# EAGLE design Standalone Kaleidoscope 8085 MPU BOARD V2 (EAGLE 8.7.0)
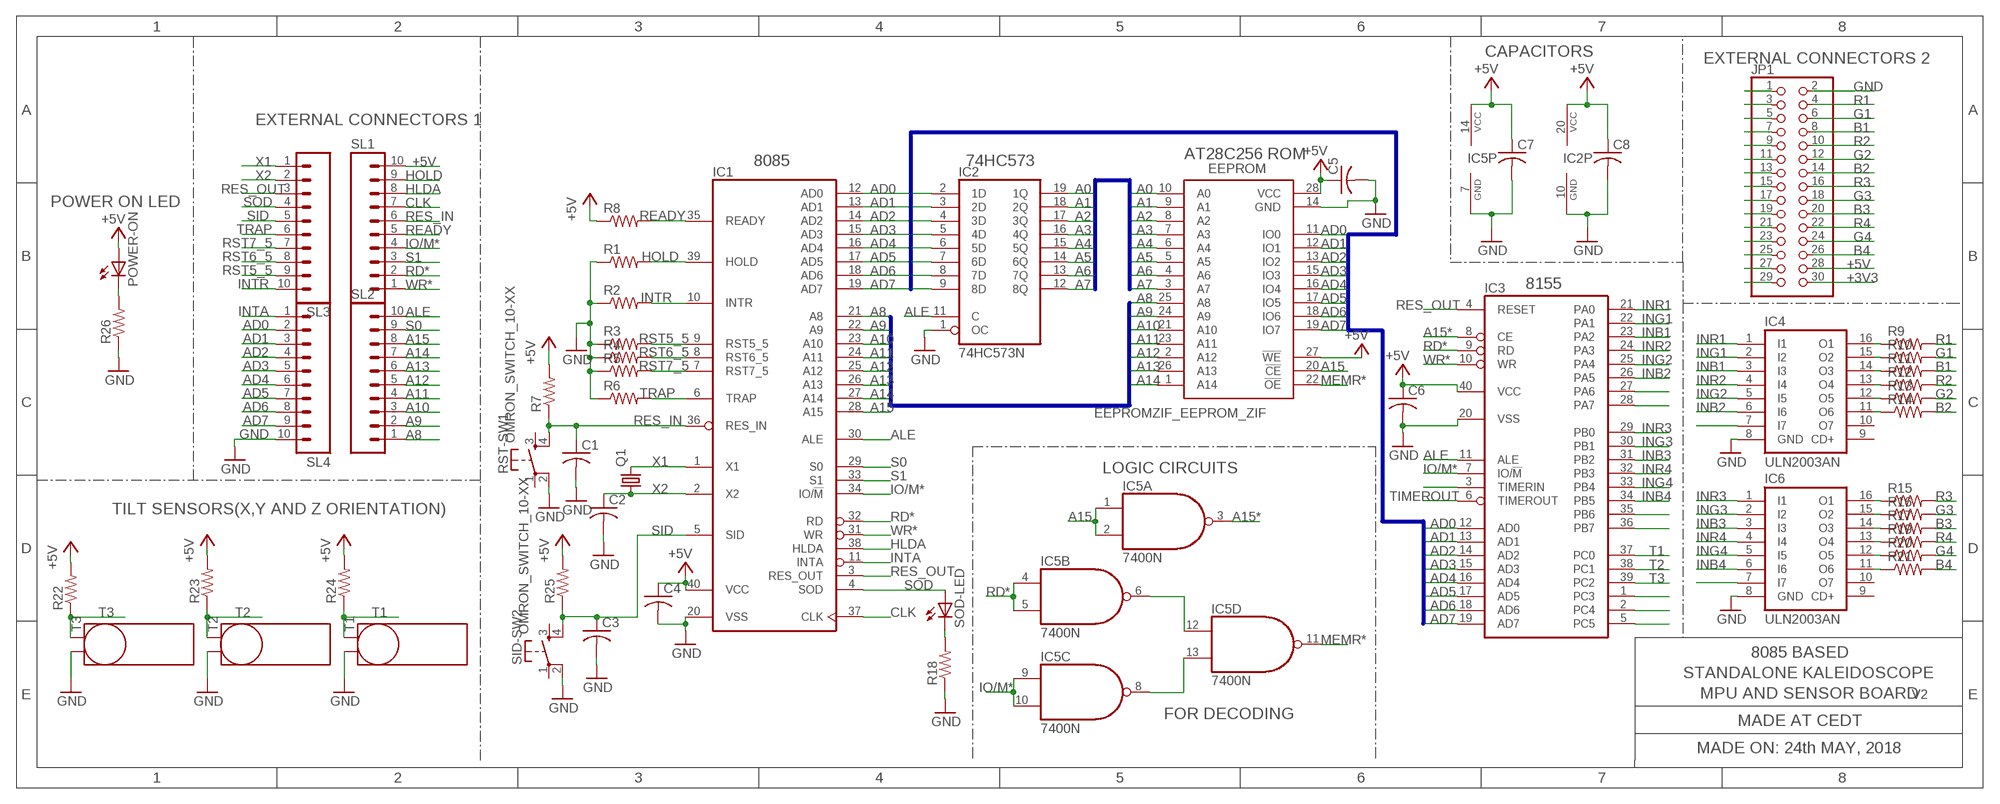
[diagram p0: schematic, sheet 1]

## Parts
C1  C-USC0805K  [C0805K]
C2  C-USC0805K  [C0805K]
C3  C-USC0805K  [C0805K]
C4  C-USC0805K  [C0805K]
C5  C-USC0805K  [C0805K]
C6  C-USC0805K  [C0805K]
C7  C-USC0805  [C0805]
C8  C-USC0805  [C0805]
EEPROM  EEPROMZIF_EEPROM_ZIF  [EEPROMZIF_DIL28-6-ZIF_SOCKET]
IC1  8085  [DIL40]
IC2  74HC573N  [DIL20]
IC3  8155  [DIL40]
IC4  ULN2003AN  [DIL16]
IC5  7400N  [DIL14]
IC6  ULN2003AN  [DIL16]
JP1  PINHD-2X15  [2X15]
POWER-ON  LEDCHIP-LED0805  [CHIP-LED0805]
Q1  CEDT_JANUARY_2015_V5_A_CRYSTALHC49US  [CEDT_JANUARY_2015_V5_A_HC49US]
R1  R-US_R0805  [R0805]
R2  R-US_R0805  [R0805]
R3  R-US_R0805  [R0805]
R4  R-US_R0805  [R0805]
R5  R-US_R0805  [R0805]
R6  R-US_R0805  [R0805]
R7  R-US_R0805  [R0805]
R8  R-US_R0805  [R0805]
R9  R-US_R0805  [R0805]
R10  R-US_R0805  [R0805]
R11  R-US_R0805  [R0805]
R12  R-US_R0805  [R0805]
R13  R-US_R0805  [R0805]
R14  R-US_R0805  [R0805]
R15  R-US_R0805  [R0805]
R16  R-US_R0805  [R0805]
R17  R-US_R0805  [R0805]
R18  R-US_R0805  [R0805]
R19  R-US_R0805  [R0805]
R20  R-US_R0805  [R0805]
R21  R-US_R0805  [R0805]
R22  R-US_R0805  [R0805]
R23  R-US_R0805  [R0805]
R24  R-US_R0805  [R0805]
R25  R-US_R0805  [R0805]
R26  R-US_R0805  [R0805]
RST-SW1  OMRON_SWITCH_10-XX  [B3F-10XX]
SID-SW2  OMRON_SWITCH_10-XX  [B3F-10XX]
SL1  CON-AMP-QUICK_M10  [CON-AMP-QUICK_10P]
SL2  CON-AMP-QUICK_M10  [CON-AMP-QUICK_10P]
SL3  CON-AMP-QUICK_M10  [CON-AMP-QUICK_10P]
SL4  CON-AMP-QUICK_M10  [CON-AMP-QUICK_10P]
SOD-LED  LEDCHIP-LED0805  [CHIP-LED0805]
T1  TILTSENSORE2.5-7  [TILTSENSOR]
T2  TILTSENSORE2.5-7  [TILTSENSOR]
T3  TILTSENSORE2.5-7  [TILTSENSOR]

## Nets
+3V3 [POWER]: JP1.29 JP1.30
+5V [POWER]: C4.1 C5.1 C6.1 C7.1 C8.1 EEPROM.27(!WE) EEPROM.28(VCC) IC1.40(VCC) IC2.20(VCC) IC3.40(VCC) IC5.14(P:VCC) JP1.27 JP1.28 POWER-ON.A R7.2 R8.1 R22.2 R23.2 R24.2 R25.2 SL1.10
A0: EEPROM.10(A0) IC2.19(1Q)
A1: EEPROM.9(A1) IC2.18(2Q)
A2: EEPROM.8(A2) IC2.17(3Q)
A3: EEPROM.7(A3) IC2.16(4Q)
A4: EEPROM.6(A4) IC2.15(5Q)
A5: EEPROM.5(A5) IC2.14(6Q)
A6: EEPROM.4(A6) IC2.13(7Q)
A7: EEPROM.3(A7) IC2.12(8Q)
A8: EEPROM.25(A8) IC1.21(A8) SL2.1
A9: EEPROM.24(A9) IC1.22(A9) SL2.2
A10: EEPROM.21(A10) IC1.23(A10) SL2.3
A11: EEPROM.23(A11) IC1.24(A11) SL2.4
A12: EEPROM.2(A12) IC1.25(A12) SL2.5
A13: EEPROM.26(A13) IC1.26(A13) SL2.6
A14: EEPROM.1(A14) IC1.27(A14) SL2.7
A15: EEPROM.20(!CE) IC1.28(A15) IC5.1(A:I0) IC5.2(A:I1) SL2.8
A15*: IC3.8(CE) IC5.3(A:O)
AD0: EEPROM.11(IO0) IC1.12(AD0) IC2.2(1D) IC3.12(AD0) SL4.2
AD1: EEPROM.12(IO1) IC1.13(AD1) IC2.3(2D) IC3.13(AD1) SL4.3
AD2: EEPROM.13(IO2) IC1.14(AD2) IC2.4(3D) IC3.14(AD2) SL4.4
AD3: EEPROM.15(IO3) IC1.15(AD3) IC2.5(4D) IC3.15(AD3) SL4.5
AD4: EEPROM.16(IO4) IC1.16(AD4) IC2.6(5D) IC3.16(AD4) SL4.6
AD5: EEPROM.17(IO5) IC1.17(AD5) IC2.7(6D) IC3.17(AD5) SL4.7
AD6: EEPROM.18(IO6) IC1.18(AD6) IC2.8(7D) IC3.18(AD6) SL4.8
AD7: EEPROM.19(IO7) IC1.19(AD7) IC2.9(8D) IC3.19(AD7) SL4.9
ALE: IC1.30(ALE) IC2.11(C) IC3.11(ALE) SL2.10
B1: JP1.7 JP1.8 R11.2
B2: JP1.13 JP1.14 R14.2
B3: JP1.19 JP1.20 R17.2
B4: JP1.25 JP1.26 R21.2
CLK: IC1.37(CLK) SL1.7
G1: JP1.5 JP1.6 R10.2
G2: JP1.11 JP1.12 R13.2
G3: JP1.17 JP1.18 R16.2
G4: JP1.23 JP1.24 R20.2
GND [POWER]: C1.2 C2.2 C3.2 C4.2 C5.2 C6.2 C7.2 C8.2 EEPROM.14(GND) IC1.20(VSS) IC2.1(OC) IC2.10(GND) IC3.20(VSS) IC4.8(GND) IC5.7(P:GND) IC6.8(GND) JP1.1 JP1.2 R1.1 R2.1 R3.1 R4.1 R5.1 R6.1 R18.1 R26.1 RST-SW1.2(P1) SID-SW2.2(P1) SL4.10 T1.- T2.- T3.-
HLDA: IC1.38(HLDA) SL1.8
HOLD: IC1.39(HOLD) R1.2 SL1.9
INB1: IC3.23(PA2) IC4.3(I3)
INB2: IC3.26(PA5) IC4.6(I6)
INB3: IC3.31(PB2) IC6.3(I3)
INB4: IC3.34(PB5) IC6.6(I6)
ING1: IC3.22(PA1) IC4.2(I2)
ING2: IC3.25(PA4) IC4.5(I5)
ING3: IC3.30(PB1) IC6.2(I2)
ING4: IC3.33(PB4) IC6.5(I5)
INR1: IC3.21(PA0) IC4.1(I1)
INR2: IC3.24(PA3) IC4.4(I4)
INR3: IC3.29(PB0) IC6.1(I1)
INR4: IC3.32(PB3) IC6.4(I4)
INTA: IC1.11(INTA) SL4.1
INTR: IC1.10(INTR) R2.2 SL3.10
IO/M*: IC1.34(IO/!M) IC3.7(IO/!M) IC5.9(C:I0) IC5.10(C:I1) SL1.4
MEMR*: EEPROM.22(!OE) IC5.11(D:O)
N$1: POWER-ON.C R26.2
N$2: IC4.16(O1) R9.1
N$3: IC4.15(O2) R10.1
N$4: IC4.14(O3) R11.1
N$5: IC5.6(B:O) IC5.12(D:I0)
N$6: IC5.8(C:O) IC5.13(D:I1)
N$7: IC4.13(O4) R12.1
N$8: IC4.12(O5) R13.1
N$9: IC4.11(O6) R14.1
N$10: IC6.11(O6) R21.1
N$11: IC6.12(O5) R20.1
N$12: IC6.13(O4) R19.1
N$13: IC3.3(TIMERIN)
N$14: IC6.14(O3) R17.1
N$15: IC6.15(O2) R16.1
N$16: R18.2 SOD-LED.C
N$17: IC6.16(O1) R15.1
N$24: IC3.27(PA6)
N$25: IC3.28(PA7)
N$26: IC3.35(PB6)
N$27: IC4.7(I7)
N$28: IC3.36(PB7)
N$32: IC3.1(PC3)
N$33: IC3.2(PC4)
N$34: IC3.5(PC5)
N$38: IC6.7(I7)
R1: JP1.3 JP1.4 R9.2
R2: JP1.9 JP1.10 R12.2
R3: JP1.15 JP1.16 R15.2
R4: JP1.21 JP1.22 R19.2
RD*: IC1.32(RD) IC3.9(RD) IC5.4(B:I0) IC5.5(B:I1) SL1.2
READY: IC1.35(READY) R8.2 SL1.5
RES_IN: C1.1 IC1.36(RES_IN) R7.1 RST-SW1.4(S1) SL1.6
RES_OUT: IC1.3(RES_OUT) IC3.4(RESET) SL3.3
RST5_5: IC1.9(RST5_5) R3.2 SL3.9
RST6_5: IC1.8(RST6_5) R4.2 SL3.8
RST7_5: IC1.7(RST7_5) R5.2 SL3.7
S0: IC1.29(S0) SL2.9
S1: IC1.33(S1) SL1.3
SID: C3.1 IC1.5(SID) R25.1 SID-SW2.4(S1) SL3.5
SOD: IC1.4(SOD) SL3.4 SOD-LED.A
T1: IC3.37(PC0) R24.1 T1.+
T2: IC3.38(PC1) R23.1 T2.+
T3: IC3.39(PC2) R22.1 T3.+
TIMEROUT: IC3.6(TIMEROUT)
TRAP: IC1.6(TRAP) R6.2 SL3.6
WR*: IC1.31(WR) IC3.10(WR) SL1.1
X1: IC1.1(X1) Q1.2 SL3.1
X2: C2.1 IC1.2(X2) Q1.1 SL3.2
Unconnected: IC4.9(CD+) IC4.10(O7) IC6.9(CD+) IC6.10(O7) RST-SW1.1(P) RST-SW1.3(S) SID-SW2.1(P) SID-SW2.3(S)

## Buses
A[0..7]
A[8..14]
AD[0..7]

## Notes on the sheet
- CAPACITORS
- EXTERNAL CONNECTORS 2
- EXTERNAL CONNECTORS 1
- AT28C256 ROM
- 8085 | 74HC573
- POWER ON LED
- 8155
- LOGIC CIRCUITS
- TILT SENSORS(X,Y AND Z ORIENTATION)
- 8085 BASED
- STANDALONE KALEIDOSCOPE
- MPU AND SENSOR BOARD | V2
- FOR DECODING
- MADE AT CEDT
- MADE ON: 24th MAY, 2018

## Library data of the parts
C1-C8 = rcl:C-US: CAPACITOR, American symbol; SPICEPREFIX: C
EEPROM = eeprom personal:EEPROMZIF_EEPROM_
IC1 = micro-intel:8085: MICROCOMPUTER/PERIPHERAL DEVICE; OC_FARNELL: unknown; OC_NEWARK: unknown
IC2 = 74xx-us:74*573: 8-bit D latch BUS DRIVER
IC3 = micro-intel:8155: MICROCOMPUTER/PERIPHERAL DEVICE; OC_FARNELL: unknown; OC_NEWARK: unknown
IC4 IC6 = uln-udn:ULN2003A: DRIVER ARRAY
IC5 = 74xx-us:74*00: Quad 2-input NAND gate
JP1 = pinhead:PINHD-2X15: PIN HEADER
POWER-ON SOD-LED = 01_adafruit:LED: LED OSRAM: - CHIPLED LG R971, LG N971, LY N971, LG Q971, LY Q971, LO R971, LY R971 LH N974, LH R974 LS Q976, LO Q976, LY Q976 LO Q996 - Hyper CHIPLED LW Q18S LB Q993, LB Q99A, LB R99A - SideLED LS A670, LO A670, LY A670, LG A670, LP A670 LB A673, LV A673, LT A673, LW A673 LH A674 LY A675 LS A676, LA A676, LO A676, LY A676, LW A676 LS A679, LY A679, LG A679 - Hyper Micro SIDELED® LS Y876, LA Y876, LO Y876, LY Y876 LT Y87S - SmartLED LW L88C, LW L88S LB L89C, LB L89S, LG L890 LS L89K, LO L89K, LY L89K LS L896, LA L896, LO L896, LY L896 - TOPLED LS T670, LO T670, LY T670, LG T670, LP T670 LSG T670, LSP T670, LSY T670, LOP T670, LYG T670 LG T671, LOG T671, LSG T671 LB T673, LV T673, LT T673, LW T673 LH T674 LS T676, LA T676, LO T676, LY T676, LB T676, LH T676, LSB T676, LW T676 LB T67C, LV T67C, LT T67C, LS T67K, LO T67K, LY T67K, LW E67C LS E67B, LA E67B, LO E67B, LY E67B, LB E67C, LV E67C, LT E67C LW T67C LS T679, LY T679, LG T679 LS T770, LO T770, LY T770, LG T770, LP T770 LB T773, LV T773, LT T773, LW T773 LH T774 LS E675, LA E675, LY E675, LS T675 LS T776, LA T776, LO T776, LY T776, LB T776 LHGB T686 LT T68C, LB T68C - Hyper Mini TOPLED® LB M676 - Mini TOPLED Santana® LG M470 LS M47K, LO M47K, LY M47K Source: http://www.osram.convergy.de/
Q1 = Board1-8085IRContolledMoodLamp:CEDT_JANUARY_2015_V5_A_CRYSTAL: Crystals Various standard crystals. Proven footprints. Spark Fun Electronics SKU : COM-00534
R1-R26 = rcl:R-US_: RESISTOR, American symbol; SPICEPREFIX: R
RST-SW1 SID-SW2 = CEDT_JANUARY_2015_v7:OMRON_SWITCH
SL1-SL4 = Board1-8085IRContolledMoodLamp:CON-AMP-QUICK_M10: AMP QUICK CONNECTOR; OC_FARNELL: unknown; OC_NEWARK: unknown
T1-T3 = tilt-sensor:TILTSENSOR: TILT SENSOR, American symbol

## Net classes
0 default: width 0.406 mm
1 POWER: width 0.61 mm

## Board
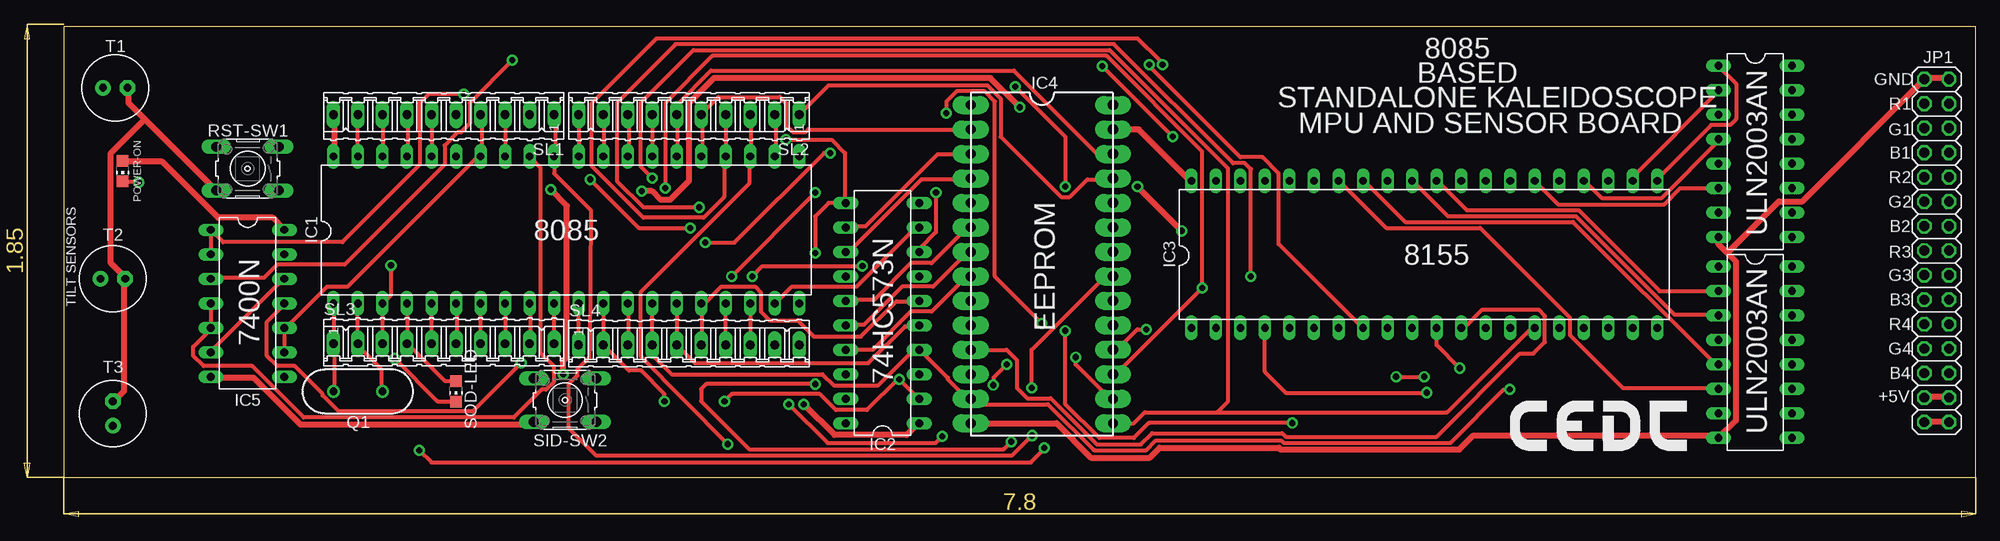
[diagram p1: board, top side]
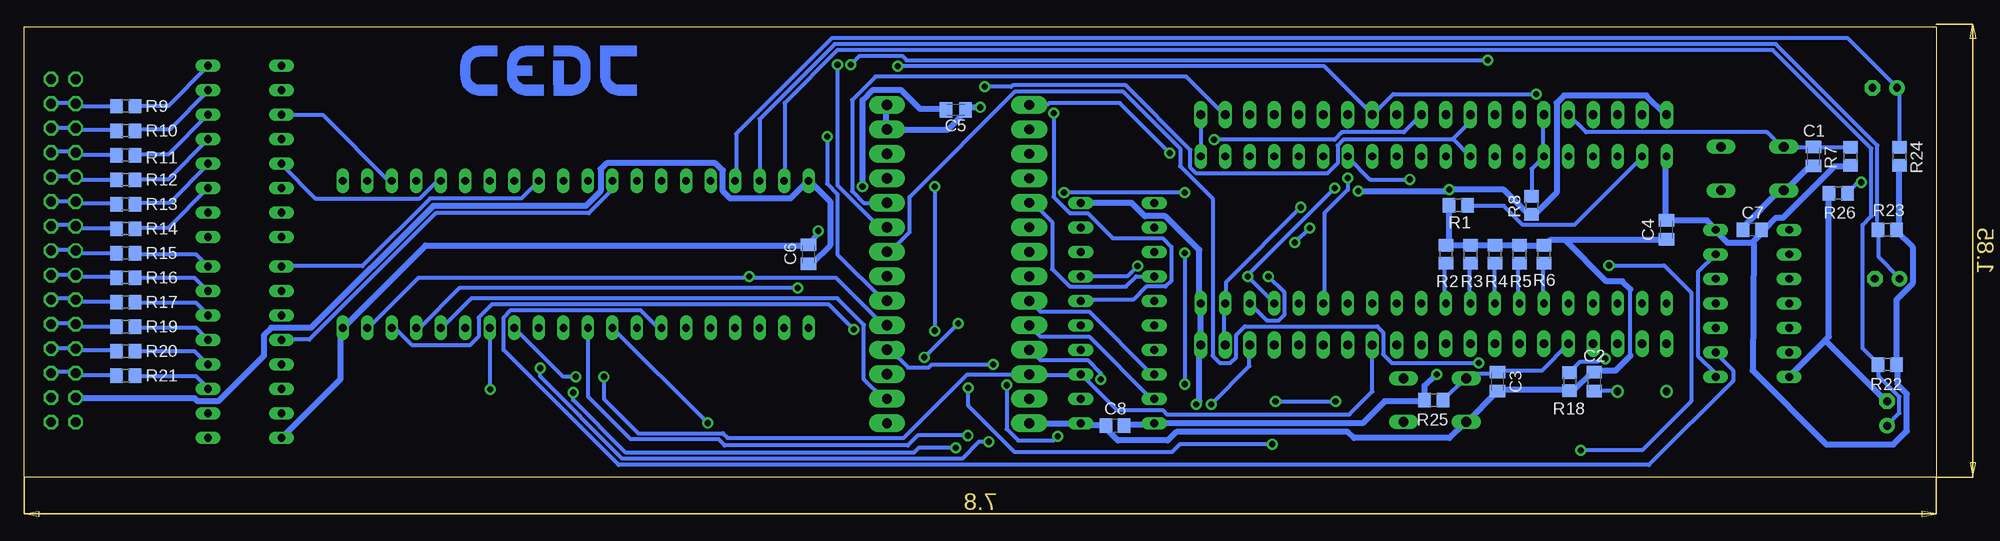
[diagram p2: board, bottom side, seen from below]

Size 198.12 x 46.74 mm. Coordinates in mm from the lower left corner, seen from the top.
Outline: 198.1,0 0,0 0,46.74 198.1,46.74
Outline: 198.12,0 198.12,46.74
Copper layers (1*16): Top 0.035mm / dielectric 1.5mm / Bottom 0.035mm
Design rules "drcsetting": minimum track width 12mil, minimum drill 25mil, track to track 8mil, track to pad 8mil, pad to pad 8mil, via to via 8mil, smd to smd 8mil, copper to edge 40mil, drill to drill 12mil, minimum pad ring 10mil, minimum via ring 10mil, stop-mask expansion 4mil, vias tented up to drill 0mil, thermal gap 10mil

### Footprints (pad centres in the part's own frame; a part is rotated, then mirrored left to right if it is on the bottom)
C0805K = smd 1.3 x 1.6: 1 -1,0; 2 1,0
C0805 = smd 1.3 x 1.5: 1 -0.95,0; 2 0.95,0
EEPROMZIF_DIL28-6-ZIF_SOCKET = drill 1.016 pad 1.88 long: 1 -24.13,-7.366; 2 -21.59,-7.366; 3 -19.05,-7.366; 4 -16.51,-7.366; 5 -13.97,-7.366; 6 -11.43,-7.366; 7 -8.89,-7.366; 8 -6.35,-7.366; 9 -3.81,-7.366; 10 -1.27,-7.366; 11 1.27,-7.366; 12 3.81,-7.366; 13 6.35,-7.366; 14 8.89,-7.366; 15 8.89,7.366; 16 6.35,7.366 | drill 1.1 pad 1.88 long: 17 3.81,7.366; 18 1.27,7.366; 19 -1.27,7.366; 20 -3.81,7.366; 21 -6.35,7.366; 22 -8.89,7.366; 23 -11.43,7.366; 24 -13.97,7.366; 25 -16.51,7.366; 26 -19.05,7.366; 27 -21.59,7.366; 28 -24.13,7.366
DIL40 = drill 0.813 long: 1 -24.13,-7.62; 2 -21.59,-7.62; 3 -19.05,-7.62; 4 -16.51,-7.62; 5 -13.97,-7.62; 6 -11.43,-7.62; 7 -8.89,-7.62; 8 -6.35,-7.62; 9 -3.81,-7.62; 10 -1.27,-7.62; 11 1.27,-7.62; 12 3.81,-7.62; 13 6.35,-7.62; 14 8.89,-7.62; 15 11.43,-7.62; 16 13.97,-7.62; 17 16.51,-7.62; 18 19.05,-7.62; 19 21.59,-7.62; 20 24.13,-7.62; 21 24.13,7.62; 22 21.59,7.62; 23 19.05,7.62; 24 16.51,7.62; 25 13.97,7.62; 26 11.43,7.62; 27 8.89,7.62; 28 6.35,7.62; 29 3.81,7.62; 30 1.27,7.62; 31 -1.27,7.62; 32 -3.81,7.62; 33 -6.35,7.62; 34 -8.89,7.62; 35 -11.43,7.62; 36 -13.97,7.62; 37 -16.51,7.62; 38 -19.05,7.62; 39 -21.59,7.62; 40 -24.13,7.62
DIL20 = drill 0.813 long: 1 -11.43,-3.81; 2 -8.89,-3.81; 3 -6.35,-3.81; 4 -3.81,-3.81; 5 -1.27,-3.81; 6 1.27,-3.81; 7 3.81,-3.81; 8 6.35,-3.81; 9 8.89,-3.81; 10 11.43,-3.81; 11 11.43,3.81; 12 8.89,3.81; 13 6.35,3.81; 14 3.81,3.81; 15 1.27,3.81; 16 -1.27,3.81; 17 -3.81,3.81; 18 -6.35,3.81; 19 -8.89,3.81; 20 -11.43,3.81
DIL16 = drill 0.813 long: 1 -8.89,-3.81; 2 -6.35,-3.81; 3 -3.81,-3.81; 4 -1.27,-3.81; 5 1.27,-3.81; 6 3.81,-3.81; 7 6.35,-3.81; 8 8.89,-3.81; 9 8.89,3.81; 10 6.35,3.81; 11 3.81,3.81; 12 1.27,3.81; 13 -1.27,3.81; 14 -3.81,3.81; 15 -6.35,3.81; 16 -8.89,3.81
DIL14 = drill 0.813 long: 1 -7.62,-3.81; 2 -5.08,-3.81; 3 -2.54,-3.81; 4 0,-3.81; 5 2.54,-3.81; 6 5.08,-3.81; 7 7.62,-3.81; 8 7.62,3.81; 9 5.08,3.81; 10 2.54,3.81; 11 0,3.81; 12 -2.54,3.81; 13 -5.08,3.81; 14 -7.62,3.81
2X15 = drill 1.016 octagon: 1 -17.78,-1.27; 2 -17.78,1.27; 3 -15.24,-1.27; 4 -15.24,1.27; 5 -12.7,-1.27; 6 -12.7,1.27; 7 -10.16,-1.27; 8 -10.16,1.27; 9 -7.62,-1.27; 10 -7.62,1.27; 11 -5.08,-1.27; 12 -5.08,1.27; 13 -2.54,-1.27; 14 -2.54,1.27; 15 0,-1.27; 16 0,1.27; 17 2.54,-1.27; 18 2.54,1.27; 19 5.08,-1.27; 20 5.08,1.27; 21 7.62,-1.27; 22 7.62,1.27; 23 10.16,-1.27; 24 10.16,1.27; 25 12.7,-1.27; 26 12.7,1.27; 27 15.24,-1.27; 28 15.24,1.27; 29 17.78,-1.27; 30 17.78,1.27
CHIP-LED0805 = smd 1.2 x 1.2: A 0,-1.05; C 0,1.05
CEDT_JANUARY_2015_V5_A_HC49US = drill 0.813: 1 -2.54,0; 2 2.54,0
R0805 = smd 1.3 x 1.5: 1 -0.95,0; 2 0.95,0
B3F-10XX = drill 1.016 long: 1 -3.251,2.261; 2 3.251,2.261; 3 -3.251,-2.261; 4 3.251,-2.261
CON-AMP-QUICK_10P = drill 0.914 long: 1 -11.43,0; 2 -8.89,0; 3 -6.35,0; 4 -3.81,0; 5 -1.27,0; 6 1.27,0; 7 3.81,0; 8 6.35,0; 9 8.89,0; 10 11.43,0
TILTSENSOR = drill 0.813 pad 1.6: + -1.27,0 | drill 0.813 pad 1.6 octagon: - 1.27,0

### Placement (x,y rotation side)
C1  12.7,33.27 270 bottom
C2  35.43,9.91 90 bottom
C3  45.47,9.91 270 bottom
C4  27.94,25.65 270 bottom
C5  101.6,38.1 180 bottom
C6  116.84,23.11 90 bottom
C7  19.05,25.65 180 bottom
C8  85.09,5.33 180 bottom
EEPROM  101.35,14.48 270 top
IC1  52.07,25.65 0 top
IC2  84.84,17.02 90 top
IC3  140.97,23.11 0 top
IC4  175.26,33.78 270 top
IC5  19.05,18.03 270 top
IC6  175.26,12.95 270 top
JP1  194.06,23.5 270 top
POWER-ON  6.1,31.75 180 top
Q1  30.48,8.89 180 top
R1  49.53,28.19 0 bottom
R2  50.8,23.11 270 bottom
R3  48.26,23.11 270 bottom
R4  45.72,23.11 270 bottom
R5  43.18,23.11 270 bottom
R6  40.64,23.11 270 bottom
R7  8.89,33.27 270 bottom
R8  41.91,28.19 90 bottom
R9  187.58,38.48 180 bottom
R10  187.58,35.94 180 bottom
R11  187.58,33.4 180 bottom
R12  187.58,30.86 180 bottom
R13  187.58,28.32 180 bottom
R14  187.58,25.78 180 bottom
R15  187.58,23.24 180 bottom
R16  187.58,20.7 180 bottom
R17  187.58,18.16 180 bottom
R18  37.97,9.91 90 bottom
R19  187.58,15.62 180 bottom
R20  187.58,13.08 180 bottom
R21  187.58,10.54 180 bottom
R22  5.08,11.68 0 bottom
R23  5.08,25.65 0 bottom
R24  3.81,33.27 270 bottom
R25  52.07,8 180 bottom
R26  10.16,29.46 0 bottom
RST-SW1  19.05,32 180 top
SID-SW2  51.94,8 180 top
SL1  39.37,37.59 180 top
SL2  64.77,37.59 180 top
SL3  39.37,13.84 0 top
SL4  64.77,13.72 0 top
SOD-LED  40.64,8.89 180 top
T1  5.33,40.39 0 top
T2  5.08,20.57 0 top
T3  5.08,6.6 90 top
U$1  [LOGO-CEDT-BOT-18MM]  134.62,39.62 0 top
U$4  [LOGO-CEDT-SILK-18MM]  149.86,2.79 0 top

### Tracks (layer width: path | path; a pad name or v marks a point on that pad's centre or on a via)
+3V3
  Top 0.61: JP1.29 192.79,5.74 195.22,5.74 JP1.30
+5V  (via drill 0.64)
  Top 0.61: IC1.40 28.04,33.33 28.04,37.59 SL1.10 | POWER-ON.A 6.1,32.72 10.21,32.72 16,26.92 21.64,26.92 22.86,25.7 IC5.14 | v50.44,29.82 52.12,28.14 52.12,12.45 51.74,12.06 v51.74,10.64 | JP1.27 192.79,8.33 195.22,8.33 JP1.28 | EEPROM.27 111.4,36.07 116.74,30.73 IC3.40 | v59.89,29.67 60.96,29.67 61.87,28.75 62.79,28.75 64.77,30.73 64.77,38.81 67.36,41.4 96.01,41.4 v99.06,38.35
  Bottom 0.61: 53.03,7.87 R25.2 | C8.1 84.12,5.44 81.23,5.44 IC2.20 59.44,5.59 57.15,7.87 53.15,7.87 R25.2 | SL1.10 28.04,37.59 30.02,39.57 38.56,39.57 39.32,38.81 39.32,29.52 41.45,27.38 41.91,27.38 R8.1 42.06,27.53 42.52,27.53 44.81,29.82 v50.44,29.82 50.6,29.67 v59.89,29.67 | R24.2 3.81,26.01 3.96,25.86 R23.2 4.12,25.55 2.44,23.88 2.44,20.07 4.12,18.39 4.12,11.68 R22.2 3.96,11.53 3.96,9.55 3.05,8.64 3.05,4.8 4.45,3.4 11.38,3.4 19.02,11.05 18.9,24.18 19.05,24.33 | 19.05,24.33 18.14,25.25 18.14,25.55 C7.1 17.83,25.7 16.61,26.92 15.85,26.92 10.52,32.26 8.99,32.26 R7.2 | 19.05,24.33 21.64,24.33 22.86,25.55 IC5.14 23.01,25.86 23.77,26.62 27.89,26.62 C4.1 28.04,26.92 28.04,33.17 IC1.40 | 52.88,8.18 R25.2 | EEPROM.28 108.81,38.51 108.81,36.22 EEPROM.27 102.41,36.07 100.74,37.74 100.74,38.05 C5.1 100.43,38.35 v99.06,38.35 | C6.1 116.74,22.2 116.43,22.2 114.61,24.03 114.61,28.6 116.74,30.73 IC3.40 117.04,30.58 118.72,28.91 124.97,28.91 125.73,29.67 125.73,31.8 126.49,32.56 137.77,32.56 138.38,31.95 138.38,29.67 139.9,28.14 155.75,28.14 168.4,15.49 172.52,15.49 173.28,14.73 173.28,12.6 178,7.87 180.14,7.87 180.44,8.18 192.79,8.18 JP1.27 | R25.2 53.02,9.49 v51.74,10.64
A0
  Bottom 0.406: EEPROM.10 92.81,14.58 87.78,14.58 81.38,8.18 81.08,8.18 IC2.19
A1
  Bottom 0.406: IC2.18 81.08,10.77 81.38,10.77 87.78,17.17 92.81,17.17 93.88,18.24 EEPROM.9
A2
  Top 0.406: IC2.17 83.82,13.21 87.78,17.17 89.92,17.17 93.57,20.83 EEPROM.8
A3
  Top 0.406: IC2.16 81.08,15.8 82.91,15.8 86.87,19.76 90.07,19.76 93.57,23.27 93.88,23.27 EEPROM.7
A4
  Top 0.406: IC2.15 81.08,18.39 83.97,18.39 87.78,22.2 89.92,22.2 93.57,25.86 93.88,25.86 EEPROM.6
A5
  Bottom 0.406: IC2.14 82.91,20.83 83.97,19.76 89.76,19.76 91.59,21.59 91.59,26.47 93.57,28.45 EEPROM.5
A6
  Top 0.406: IC2.13 81.08,23.42 81.38,23.42 88.85,30.89 93.88,30.89 EEPROM.4
A7
  Top 0.406: IC2.12 81.08,26.01 83.06,26.01 90.53,33.48 93.88,33.48 EEPROM.3
A8
  Top 0.406: SL2.1 79.25,40.64 95.71,40.64 97.08,39.27 97.08,35.31 103.33,29.06 104.24,29.06 106.07,30.89 108.66,30.89 EEPROM.25
  Bottom 0.406: SL2.1 IC1.21
A9
  Top 0.406: IC1.22 73.76,33.33 73.76,37.59 SL2.2
  Bottom 0.406: EEPROM.24 111.1,28.45 112.32,29.67 112.32,39.12 109.88,41.55 77.72,41.55 73.76,37.59 SL2.2
A10  (via drill 0.64)
  Top 0.406: SL2.3 71.17,37.59 71.17,33.33 IC1.23 71.02,33.17 71.02,30.43 59.74,19.15 59.74,12.6 v68.78,3.43 | EEPROM.21 107.9,20.83 100.28,13.21 v100.28,9.25
  Bottom 0.406: v100.28,9.25 100.28,7.42 95.45,2.59 79.2,2.59 78.36,3.43 v68.78,3.43
A11  (via drill 0.64)
  Top 0.406: SL2.4 IC1.24 68.43,33.17 68.43,29.06 66.29,26.92 60.05,26.92 54.71,32.26 54.71,38.81 61.42,45.52 111.25,45.52 113.54,43.23 113.54,43.08 v113.84,42.77
  Bottom 0.406: v113.84,42.77 113.84,30.28 109.58,26.01 108.81,26.01 EEPROM.23
A12
  Top 0.406: IC1.25 66.14,33.33 66.14,37.59 SL2.5 66.14,37.74 67.82,39.42 74.22,39.42 74.83,38.81 74.83,36.52 75.59,35.76 76.81,35.76 77.11,36.07 EEPROM.2
A13
  Top 0.406: IC1.26 63.55,33.33 63.55,37.59 SL2.6 63.55,37.74 63.55,38.66 67.06,42.16 98.45,42.16 106.98,33.63 108.66,33.63 EEPROM.26
A14  (via drill 0.64)
  Top 0.406: SL2.7 IC1.27 | v79.4,33.63 78.79,33.63 69.49,24.33 v66.45,24.33 | v64.92,25.86 59.59,25.86 v54.56,30.89
  Bottom 0.406: v79.4,33.63 84.58,38.81 91.9,38.81 92.05,38.66 93.88,38.66 EEPROM.1 | v64.92,25.86 v66.45,24.33 | v54.56,30.89 58.67,30.89 60.96,33.17 IC1.27
A15  (via drill 0.64)
  Top 0.406: IC5.2 IC5.1 16.51,24.38 28.85,24.38 36.88,32.41 36.88,38.81 37.8,39.73 v41.45,39.73 | IC1.28 58.52,33.33 58.52,37.59 SL2.8 | v107.59,42.62 v114.91,35.31
  Bottom 0.406: v41.45,39.73 56.24,39.73 58.37,37.59 SL2.8 58.52,37.74 63.4,42.62 v107.59,42.62 | v114.91,35.31 114.91,30.43 113.84,29.36 113.84,23.11 109.12,18.39 108.81,18.39 EEPROM.20
A15*  (via drill 0.64)
  Top 0.406: v46.48,43.23 42.06,38.81 42.06,36.68 41.15,35.76 40.84,35.76 39.47,34.39 39.47,32.41 29.11,22.05 22.1,22.05 20.73,20.68 15.24,20.68 IC5.3 | v112.47,42.77 112.78,42.47 112.78,42.32 121.92,33.17 124.21,33.17 125.88,31.5 125.88,24.18 134.57,15.49 IC3.8
  Bottom 0.406: v46.48,43.23 106.68,43.23 107.14,43.69 111.56,43.69 v112.47,42.77
AD0  (via drill 0.64, 0.65)
  Top 0.406: IC1.12 55.93,17.93 55.93,13.82 SL4.2 58.55,11.05 59.82,11.05 62.23,8.64 v62.23,7.87 | IC2.2 88.54,8.18 v86.56,10.16 86.41,10.16 83.21,6.96 80.01,6.96 78.33,8.64 69.22,8.64 v68.45,7.87 | IC3.12 145.09,15.49 146.91,17.32 152.86,17.32 153.47,16.71 153.47,14.02 152.27,12.83 150.88,12.83 142.24,4.19 126.62,4.19 126.24,4.57 112.78,4.57 111.61,3.4 107.04,3.4 102.26,8.18 99.82,8.18 98.75,9.25 98.75,12.14 97.69,13.21 EEPROM.11
  Bottom 0.406: v86.56,10.16 86.56,10.77 87.94,12.14 92.81,12.14 93.88,13.21 EEPROM.11 | v68.45,7.87 v62.23,7.87
AD1  (via drill 0.65)
  Top 0.406: IC1.13 58.52,17.93 58.52,13.82 SL4.3 | v138.05,10.41 v140.97,10.41
  Bottom 0.406: 147.22,15.49 IC3.13 142.24,10.41 v140.97,10.41 | 58.52,13.66 SL4.3 58.42,8.89 60.81,6.5 79.7,6.5 80.16,6.96 84.89,6.96 88.54,10.62 IC2.3 88.7,10.62 93.88,10.62 EEPROM.12 94.03,10.62 100.43,10.62 106.98,4.06 125.22,4.06 125.73,4.57 134.49,4.57 138.05,8.13 v138.05,10.41 138.05,10.54
AD2  (via drill 0.64)
  Top 0.406: SL4.4 IC1.14 | v149.81,9.09 149.2,9.09 143.69,3.58 126.37,3.58 126.14,3.81 113.16,3.81 112.14,2.79 106.78,2.79 106.76,2.82 106.7,2.82 101.96,7.57 94.49,7.57 94.03,8.03 EEPROM.13 93.88,8.18 93.57,8.18 91.59,10.16 91.59,10.31 88.7,13.21 IC2.4 88.54,13.06 87.94,13.06 84.4,9.53 79.76,9.53 78.61,10.67 62.99,10.67 60.96,12.7 SL4.4 | 61.11,13.66 SL4.4
  Bottom 0.406: v149.81,9.09 149.81,15.49 IC3.14
AD3  (via drill 0.64)
  Top 0.406: IC1.15 63.55,17.93 63.55,13.82 SL4.5 65.38,11.84 83.36,11.84 87.17,15.65 88.54,15.65 IC2.5 | IC3.15 152.09,15.49 143.33,6.73 119.51,6.73 | v60.96,31.04 59.74,32.26 59.74,38.81 65.23,44.3 108.36,44.3 120.65,32 120.65,7.87 119.51,6.73 | EEPROM.15 110.87,5.59 112.01,6.73 119.51,6.73
  Bottom 0.406: v60.96,31.04 60.96,29.82 63.4,27.38 63.4,18.09 IC1.15
AD4  (via drill 0.64)
  Top 0.406: SL4.6 66.14,13.82 66.14,17.93 IC1.16 66.29,17.93 68.12,19.76 71.63,19.76 72.24,19.15 72.24,17.17 73.15,16.26 76.05,16.26 77.72,14.58 82.6,14.58 86.26,18.24 88.54,18.24 IC2.6 | v91.44,37.74 91.44,38.96 92.51,40.03 95.4,40.03 96.47,38.96 96.47,20.83 v101.35,15.95 | v104.85,12.45 104.85,11.68 108.36,8.18 108.66,8.18 EEPROM.16
  Bottom 0.406: IC3.16 154.84,15.49 151.79,18.54 113.84,18.54 111.1,15.8 111.1,10.16 109.12,8.18 108.81,8.18 EEPROM.16 | v91.44,37.74 91.44,29.06 89.76,27.38 87.94,27.38 85.34,24.79 80.16,24.79 79.25,23.88 79.25,20.37 79.86,19.76 81.84,19.76 83.21,18.39 88.54,18.39 IC2.6 | v104.85,12.45 v101.35,15.95
AD5  (via drill 0.64)
  Top 0.406: SL4.7 IC1.17 | v82.75,21.89 72.39,21.89 v71.32,20.83 | EEPROM.17 108.81,10.77 109.12,10.77 v117.96,19.61 117.96,33.78 108.05,43.69 67.21,43.69 62.33,38.81 v62.33,29.97
  Bottom 0.406: IC2.7 83.82,20.83 v82.75,21.89 | IC1.17 68.58,18.09 v71.32,20.83 71.32,20.98 v62.33,29.97 | IC3.17 157.12,15.49 153.01,19.61 v117.96,19.61
AD6  (via drill 0.64)
  Top 0.406: IC1.18 71.17,17.93 71.17,13.82 SL4.8 | v90.37,29.52 90.37,25.4 88.7,23.72 88.7,23.42 IC2.8 | v69.19,20.83 v77.88,29.52 | v112.17,15.34 111.25,15.34 109.12,13.21 EEPROM.18 | v75.13,7.57 79.15,3.56 90.32,3.56 v91.01,4.24 | v96.32,9.55 96.32,10.31 v97.69,11.68
  Bottom 0.406: v77.88,29.52 v90.37,29.52 | v69.19,20.83 67.51,19.15 67.51,16.87 68.12,16.26 69.34,16.26 IC1.18 | IC3.18 159.72,15.49 157.89,13.66 151.94,13.66 151.03,14.58 151.03,16.56 149.66,17.93 114.76,17.93 v112.17,15.34 | v75.13,7.57 71.17,11.53 71.17,13.66 SL4.8 | v96.32,9.55 96.32,5 | 96.32,5 96.32,4.98 | v97.69,11.68 104.09,11.68 104.39,11.38 106.53,11.38 108.36,13.21 EEPROM.18 | v91.01,4.24 91.44,3.81 95.12,3.81 96.32,5
AD7  (via drill 0.64)
  Top 0.406: IC2.9 88.54,25.86 88.24,25.86 82.14,19.76 75.44,19.76 73.76,18.09 IC1.19 | v65.84,27.99 60.05,27.99 57.3,30.73 57.3,38.81 63.4,44.91 108.81,44.91 121.16,32.56 122.38,32.56 122.99,31.95 v122.99,20.83
  Bottom 0.406: SL4.9 73.76,13.82 73.76,17.93 IC1.19 73.61,18.09 73.61,20.22 v65.84,27.99 | 122.99,20.68 114,20.68 109.12,15.8 108.81,15.8 EEPROM.19 | 122.99,20.68 157.28,20.68 162.46,15.49 IC3.19 | v122.99,20.83 122.99,20.68
ALE  (via drill 0.64, 0.65)
  Top 0.406: SL2.10 IC1.30 | v74.83,35 79.55,35 80.92,33.63 80.92,28.45 IC2.11 79.25,28.45 77.85,27.05 v77.85,23.24 | v77.85,9.65 66.55,9.65 66.04,9.14 66.04,7.87 71.02,2.9 97.38,2.9 v98.17,3.68 | v144.65,11.3 142.24,13.72 IC3.11
  Bottom 0.406: v74.83,35 62.33,35 61.57,35.76 55.17,35.76 SL2.10 | v77.85,23.24 v77.85,9.65 | v98.17,3.68 99.19,3.68 100.94,1.93 136.13,1.93 144.65,10.45 v144.65,11.3
B1
  Bottom 0.406: R11.2 188.67,33.48 192.63,33.48 192.79,33.63 JP1.7 192.94,33.78 195.22,33.78 JP1.8
B2
  Bottom 0.406: R14.2 188.67,25.86 192.63,25.86 192.79,26.01 JP1.13 192.94,26.16 195.22,26.16 JP1.14
B3
  Bottom 0.406: R17.2 188.67,18.24 192.63,18.24 192.79,18.39 JP1.19 192.94,18.54 195.22,18.54 JP1.20
B4
  Bottom 0.406: R21.2 188.67,10.62 192.63,10.62 192.79,10.77 JP1.25 192.94,10.92 195.22,10.92 JP1.26
CLK
  Top 0.406: IC1.37 35.66,33.33 35.66,37.59 SL1.7
G1
  Bottom 0.406: R10.2 188.67,36.07 192.79,36.07 JP1.5 192.94,36.22 195.22,36.22 JP1.6
G2
  Bottom 0.406: R13.2 188.67,28.45 192.79,28.45 JP1.11 192.94,28.6 195.22,28.6 JP1.12
G3
  Bottom 0.406: R16.2 188.67,20.83 192.79,20.83 JP1.17 192.94,20.98 195.22,20.98 JP1.18
G4
  Bottom 0.406: R20.2 188.67,13.21 192.79,13.21 JP1.23 192.94,13.36 195.22,13.36 JP1.24
GND  (via drill 0.64)
  Top 0.61: 8.38,37.13 15.7,29.82 RST-SW1.2 | 8.38,37.13 6.71,38.81 6.71,40.34 T1.- | T3.- 5.18,7.87 6.25,8.94 6.25,20.52 T2.- 6.25,20.83 4.88,22.2 4.88,33.63 8.38,37.13 | v76.66,7.57 79.86,4.37 87.33,4.37 88.54,5.59 IC2.1 | IC5.7 15.24,10.31 19.66,10.31 24.54,5.44 48.31,5.44 48.62,5.74 SID-SW2.2 | JP1.2 195.22,41.4 192.79,41.4 JP1.1 192.63,41.1 180.14,28.6 177.7,28.6 172.36,23.27 | v115.82,25.55 v111.25,30.12 | IC4.8 171.45,24.18 172.36,23.27 | 172.36,23.27 173.28,22.35 173.28,5.89 IC6.8 171.2,4.32 146.05,4.32 144.6,2.87 126.07,2.87 125.89,3.05 113.54,3.05 112.52,2.03 106.43,2.03 102.87,5.59 EEPROM.14
  Bottom 0.406: 31.7,12.6 31.7,19.51
  Bottom 0.61: C7.2 19.96,25.7 19.96,26.01 16.31,29.67 15.85,29.67 RST-SW1.2 15.54,29.82 13.11,32.26 12.8,32.26 C1.2 | 11.51,14.2 15.24,10.46 IC5.7 | 11.51,14.2 11.12,14.58 11.12,29.36 R26.1 | 11.51,14.2 5.18,7.87 T3.- | IC2.10 83.36,28.45 81.99,27.08 79.86,27.08 76.35,23.57 76.35,18.24 IC1.20 SL4.10 76.35,13.51 76.35,7.87 v76.66,7.57 | R1.1 50.44,28.14 50.44,24.18 R2.1 50.75,24.03 48.46,24.03 R3.1 48.16,24.03 45.87,24.03 R4.1 45.72,24.03 43.43,24.03 R5.1 43.13,24.03 40.69,24.03 R6.1 40.39,24.18 39.93,24.64 38.48,24.64 | 38.48,24.64 28.04,24.64 C4.2 | EEPROM.14 IC2.1 88.54,5.59 88.39,5.44 86.11,5.44 C8.2 85.8,5.13 85.8,4.83 84.78,3.81 79.63,3.81 78.74,4.7 60.96,4.7 60.33,4.06 50.44,4.06 48.92,5.59 SID-SW2.2 48.62,5.74 45.57,8.79 C3.2 45.26,9.09 38.25,9.09 R18.1 37.95,9.09 37.49,9.09 35.81,10.77 35.51,10.77 C2.2 35.2,11.07 33.22,11.07 31.7,12.6 | v111.25,30.12 111.25,39.12 110.19,40.18 107.29,40.18 105.31,38.2 102.72,38.2 C5.2 | v115.82,25.55 115.82,25.25 116.74,24.33 C6.2 116.89,24.03 156.51,24.03 165.05,15.49 IC3.20 165.35,15.34 165.35,10.16 IC6.8 | 31.7,19.51 32.51,20.32 34.16,20.32 38.48,24.64
HLDA
  Top 0.406: IC1.38 33.07,33.33 33.07,37.59 SL1.8
HOLD
  Top 0.406: IC1.39 SL1.9
  Bottom 0.406: R1.2 48.46,28.14 44.81,28.14 42.82,26.16 37.49,26.16 30.48,33.17 IC1.39
INB1
  Bottom 0.406: IC3.23 160.32,30.73 167.18,37.59 IC4.3
INB2
  Top 0.406: IC4.6 167.49,29.97 165.81,28.3 154.84,28.3 IC3.26
INB3
  Top 0.406: IC6.3 171.45,16.87 166.88,16.87 156.67,27.08 143.41,27.08 139.75,30.73 IC3.31
INB4
  Top 0.406: IC6.6 171.45,9.25 161.54,9.25 156.06,14.73 156.06,16.56 146.76,25.86 137.01,25.86 132.13,30.73 IC3.34
ING1
  Top 0.406: IC3.22 162.61,30.73 162.61,31.19 171.45,40.03 IC4.2
ING2
  Bottom 0.406: IC3.25 155.3,30.73 157.12,28.91 167.94,28.91 171.45,32.41 IC4.5
ING3
  Top 0.406: IC6.2 165.35,19.3 156.97,27.69 145.39,27.69 142.34,30.73 IC3.30
ING4
  Top 0.406: IC6.5 171.15,11.68 156.36,26.47 138.99,26.47 134.72,30.73 IC3.33
INR1
  Top 0.406: IC3.21 165.2,30.73 165.2,31.04 170.69,36.52 172.67,36.52 173.28,37.13 173.28,40.79 171.45,42.62 IC4.1
INR2
  Top 0.406: IC4.4 171.45,34.85 165.51,28.91 159.41,28.91 157.58,30.73 IC3.24
INR3
  Bottom 0.406: IC3.29 146.61,28.91 156.06,28.91 163.07,21.89 171.45,21.89 IC6.1
INR4
  Bottom 0.406: IC3.32 137.16,29.82 139.6,27.38 155.45,27.38 168.55,14.28 171.45,14.28 IC6.4
INTA
  Top 0.406: SL4.1 IC1.11
INTR
  Top 0.406: SL3.10 50.75,13.97 50.75,17.93 IC1.10
  Bottom 0.406: R2.2 50.9,22.05 50.9,18.09 IC1.10
IO/M*
  Top 0.406: SL1.4 43.28,37.59 43.28,33.33 IC1.34 43.13,33.17 42.82,33.17 29.41,19.76 27.28,19.76 23.01,15.49 IC5.10 IC5.9
  Bottom 0.406: IC3.7 132.44,15.49 134.26,17.32 147.68,17.32 148.44,16.56 148.44,13.18 136.53,1.27 29.77,1.27 21.03,10.01 21.03,11.07 22.86,12.9 IC5.9
MEMR*  (via drill 0.64)
  Top 0.406: v47.4,11.84 42.37,6.81 28.5,6.81 26.82,8.48 26.82,8.64 23.93,11.53 22.1,11.53 21.03,12.6 21.03,16.1 22.86,17.93 IC5.11
  Bottom 0.406: v47.4,11.84 56.39,11.84 57.3,12.75 57.3,15.04 57.91,15.65 71.63,15.65 72.54,14.73 72.54,12.45 73.15,11.84 74.22,11.84 74.98,12.6 74.98,28.91 78.33,32.26 78.33,34.09 84.28,40.03 95.4,40.03 106.38,29.06 106.38,25.4 108.36,23.42 108.66,23.42 EEPROM.22
N$1  (via drill 0.64)
  Top 0.406: v7.77,30.58 6.1,30.58 POWER-ON.C
  Bottom 0.406: v7.77,30.58 8.08,30.58 9.14,29.52 R26.2
N$2
  Bottom 0.406: R9.1 186.54,38.51 183.19,38.51 179.07,42.62 IC4.16
N$3
  Bottom 0.406: R10.1 186.54,36.07 183.03,36.07 179.07,40.03 IC4.15
N$4
  Bottom 0.406: IC4.14 183.19,33.48 186.54,33.48 R11.1
N$5
  Top 0.406: IC5.6 15.24,13.06 22.86,20.68 IC5.12
N$6
  Bottom 0.406: IC5.8 22.86,10.77 24.69,12.6 24.69,21.29 IC5.13
N$7
  Bottom 0.406: R12.1 186.54,30.89 183.19,30.89 179.07,35 IC4.13
N$8
  Bottom 0.406: R13.1 186.54,28.45 183.03,28.45 179.07,32.41 IC4.12
N$9
  Bottom 0.406: IC4.11 183.19,25.86 186.54,25.86 R14.1
N$10
  Bottom 0.406: R21.1 186.54,10.46 180.29,10.46 179.07,9.25 IC6.11
N$11
  Bottom 0.406: IC6.12 180.44,13.06 186.54,13.06 R20.1
N$12
  Bottom 0.406: R19.1 186.54,15.49 180.29,15.49 179.07,14.28 IC6.13
N$14
  Bottom 0.406: R17.1 186.54,18.09 180.29,18.09 179.07,16.87 IC6.14
N$15
  Bottom 0.406: IC6.15 180.44,20.68 186.54,20.68 R16.1
N$16  (via drill 0.64)
  Top 0.406: v34.29,12.29 38.71,7.87 40.54,7.87 SOD-LED.C
  Bottom 0.406: v34.29,12.29 34.75,12.29 35.05,11.99 36.88,11.99 37.95,10.92 R18.2
N$17
  Bottom 0.406: R15.1 186.54,23.11 180.29,23.11 179.07,21.89 IC6.16
R1
  Bottom 0.406: R9.2 188.67,38.51 192.63,38.51 192.79,38.66 JP1.3 192.94,38.81 195.22,38.81 JP1.4
R2
  Bottom 0.406: R12.2 188.67,30.89 192.63,30.89 192.79,31.04 JP1.9 192.94,31.19 195.22,31.19 JP1.10
R3
  Bottom 0.406: R15.2 188.67,23.27 192.63,23.27 192.79,23.42 JP1.15 192.94,23.57 195.22,23.57 JP1.16
R4
  Bottom 0.406: R19.2 188.67,15.65 192.63,15.65 192.79,15.8 JP1.21 192.94,15.95 195.22,15.95 JP1.22
RD*  (via drill 0.64)
  Top 0.406: IC5.4 IC5.5 15.24,15.34 13.41,13.51 13.41,12.6 14.48,11.53 19.51,11.53 24.84,6.2 46.63,6.2 49.53,9.09 49.99,9.09 50.75,9.86 50.75,11.53 49.38,12.9 49.38,32.11 48.31,33.17 IC1.32 | v103.78,15.19 103.78,7.57 107.29,4.06 110.87,4.06 112.42,5.61 v127.28,5.61 | v103.78,30.12 103.78,35.31 v98.6,40.49
  Bottom 0.406: v127.28,5.61 IC3.9 | v103.78,30.12 v103.78,15.19 | v98.6,40.49 95.86,40.49 95.71,40.64 83.97,40.64 77.27,33.93 77.27,32.11 76.66,31.5 63.09,31.5 62.03,32.56 62.03,34.39 61.42,35 49.99,35 | IC1.32 49.99,35 | SL1.2 48.31,37.59 48.31,36.83 49.99,35.15 49.99,35
READY
  Bottom 0.406: R8.2 41.91,31.95 40.69,33.17 IC1.35 40.69,33.33 40.69,37.59 SL1.5
RES_IN
  Top 0.406: SL1.6 IC1.36
  Bottom 0.406: R7.1 8.99,34.24 12.65,34.24 C1.1 12.8,34.24 15.7,34.24 RST-SW1.4 16,34.24 17.53,35.76 36.27,35.76 SL1.6
RES_OUT  (via drill 0.65)
  Top 0.406: SL3.3 33.07,13.97 33.07,17.93 IC1.3 33.91,18.92 v33.91,21.97 | v36.83,2.79 38.1,1.52 100.2,1.52 101.6,2.92 v101.6,3.05 | IC3.4 124.46,10.92 126.62,8.76 v141.22,8.76
  Bottom 0.406: v33.91,21.97 28.19,21.97 25.4,19.18 25.4,7.87 30.48,2.79 v36.83,2.79 | v101.6,3.05 105.41,3.05 105.92,2.54 135.76,2.54 141.22,8 v141.22,8.76
RST5_5
  Top 0.406: SL3.9 48.31,13.97 48.31,17.93 IC1.9
  Bottom 0.406: R3.2 48.31,22.05 48.31,18.09 IC1.9
RST6_5
  Top 0.406: IC1.8 SL3.8
  Bottom 0.406: IC1.8 R4.2
RST7_5
  Top 0.406: SL3.7 43.13,13.97 43.13,17.93 IC1.7
  Bottom 0.406: R5.2 43.28,22.05 43.28,18.09 IC1.7
S0
  Top 0.406: IC1.29 55.93,33.33 55.93,37.59 SL2.9
S1
  Top 0.406: SL1.3 IC1.33
SID
  Top 0.406: SL3.5 IC1.5
  Bottom 0.406: R25.1 51.05,8.03 48.77,10.31 SID-SW2.4 48.62,10.31 48.16,10.77 45.57,10.77 C3.1 45.41,11.07 40.84,11.07 38.1,13.82 SL3.5
SOD
  Top 0.406: SOD-LED.A 40.54,10.01 39.47,10.01 35.66,13.82 SL3.4 35.66,13.97 35.66,17.93 IC1.4
T1
  Bottom 0.406: R24.1 3.81,40.18 3.96,40.34 T1.+ 4.12,40.49 9.14,45.52 114.45,45.52 124.36,35.61 124.36,30.73 IC3.37
T2
  Bottom 0.406: T2.+ 3.81,20.68 5.94,22.81 5.94,25.55 R23.1 6.1,25.86 6.1,34.39 16.61,44.91 114.15,44.91 121.92,37.13 IC3.38
T3
  Bottom 0.406: T3.+ 5.03,5.44 3.81,6.66 3.81,8.33 5.94,10.46 5.94,11.68 R22.1 6.1,11.84 7.62,13.36 7.62,26.16 6.71,27.08 6.71,34.09 16.92,44.3 113.84,44.3 119.33,38.81 119.33,30.73 IC3.39
TRAP
  Top 0.406: SL3.6 40.69,13.97 40.69,17.93 IC1.6
  Bottom 0.406: R6.2 40.69,22.05 40.69,18.09 IC1.6
WR*  (via drill 0.65)
  Top 0.406: SL1.1 50.9,37.59 50.9,33.33 IC1.31 50.8,31.5 54.61,27.69 54.49,13.08 54.49,12.46 53.21,11.18 53.21,10.54 52.32,9.65 52.32,5.08 55.12,2.29 98.3,2.29 v100.33,4.32
  Bottom 0.406: v100.33,4.32 105.54,4.32 106.55,3.3 125.53,3.3 126.16,3.94 135.25,3.94 139.7,8.38 IC3.10
X1
  Top 0.406: Q1.2 28.04,8.94 28.04,13.82 SL3.1 28.04,13.97 28.04,17.93 IC1.1
X2
  Top 0.406: IC1.2 SL3.2 30.48,13.66 32.92,11.23 32.92,8.94 Q1.1
  Bottom 0.406: C2.1 35.36,8.94 33.07,8.94 Q1.1

### Text on the board
tPlace: 8085 | BASED | STANDALONE KALEIDOSCOPE | MPU AND SENSOR BOARD
tNames: IC4 | GND | R1 | G1 | B1 | R2 | G2 | 8085 | B2 | TILT SENSORS | 8155 | R3 | EEPROM | G3 | B3 | R4 | G4 | B4 | +5V